# EAGLE design HotRod (EAGLE 7.1.0)
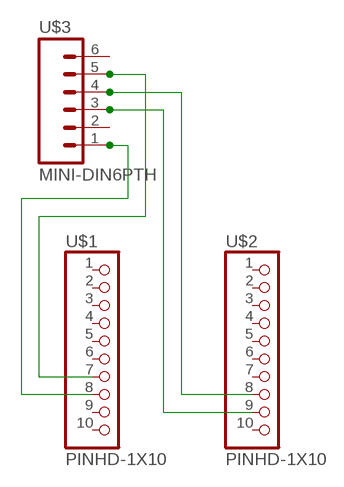
[diagram p0: schematic, sheet 1]

## Parts
U$1  PINHD-1X10  [1X10-BIG]
U$2  PINHD-1X10  [1X10-BIG]
U$3  MINI-DIN6PTH  [MINI-DIN6]

## Nets
N$1: U$1.8 U$3.1
N$2: U$1.7 U$3.5
N$3: U$2.8 U$3.4
N$5: U$2.9 U$3.3
Unconnected: U$1.1 U$1.2 U$1.3 U$1.4 U$1.5 U$1.6 U$1.9 U$1.10 U$2.1 U$2.2 U$2.3 U$2.4 U$2.5 U$2.6 U$2.7 U$2.10 U$3.2 U$3.6

## Library data of the parts
U$1 U$2 = adafruit:PINHD-1X10: Pin header 1x10 0.1" spacing With round pins
U$3 = SparkFun-Connectors:MINI-DIN6: mini DIN 6 Connector Commonly found on the back of a computer for PS2 keyboard and mice. Schematic and footprint are proven. Spark Fun Electronics SKU : PRT-08509

## Board
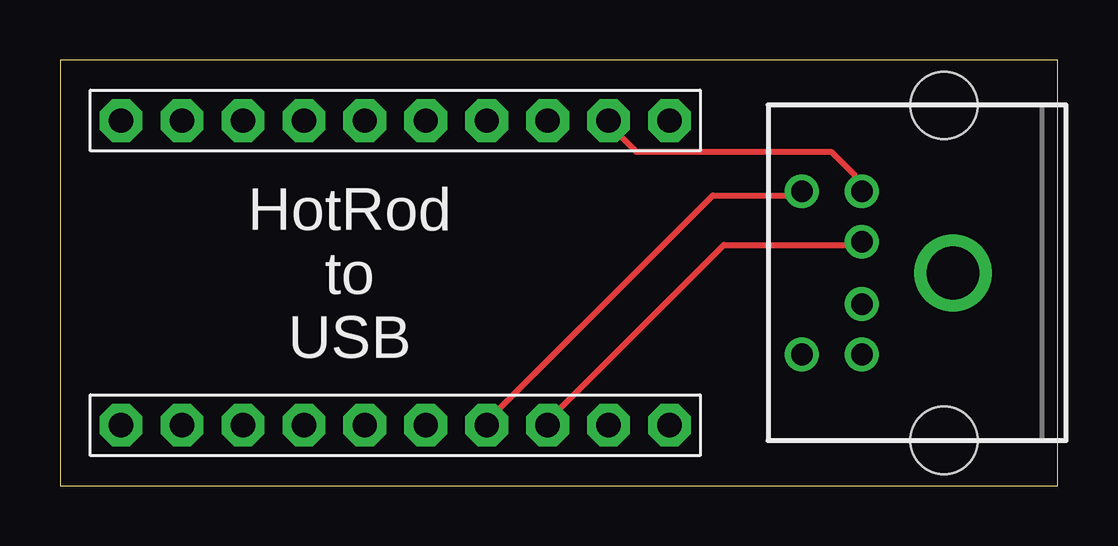
[diagram p1: board, top side]
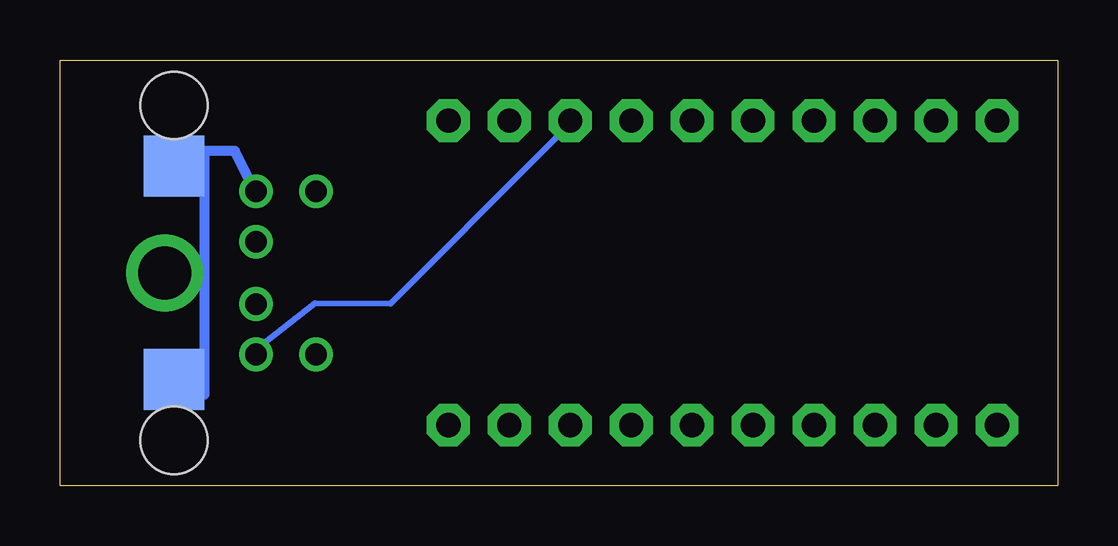
[diagram p2: board, bottom side, seen from below]

Size 41.58 x 17.77 mm. Coordinates in mm from the lower left corner, seen from the top.
Outline: 0,0 41.58,0 41.58,17.77 0,17.77 0,0
Copper layers (1*16): Top 0.035mm / dielectric 1.5mm / Bottom 0.035mm
Design rules "default": minimum track width 10mil, minimum drill 24mil, track to track 8mil, track to pad 8mil, pad to pad 8mil, via to via 8mil, smd to smd 8mil, copper to edge 40mil, drill to drill 8mil, minimum pad ring 10mil, minimum via ring 8mil, stop-mask expansion 4mil, vias tented up to drill 0mil, thermal gap 10mil

### Footprints (pad centres in the part's own frame; a part is rotated, then mirrored left to right if it is on the bottom)
1X10-BIG = drill 1.016 pad 1.778 octagon: 1 -11.43,0; 2 -8.89,0; 3 -6.35,0; 4 -3.81,0; 5 -1.27,0; 6 1.27,0; 7 3.81,0; 8 6.35,0; 9 8.89,0; 10 11.43,0
MINI-DIN6 = drill 0.9: 1 -1.3,-8.5; 2 1.3,-8.5; 3 -3.4,-8.5; 4 3.4,-8.5; 5 -3.4,-11; 6 3.4,-11 | drill 2.2: P$1 0,-4.7 | smd 2.54 x 2.54 bottom: P$2 -4.445,-5.08; P$3 4.445,-5.08 | hole 2.8: -6.985,-5.08; 6.985,-5.08

### Placement (x,y rotation side)
U$1  13.97,2.54 0 top
U$2  13.97,15.24 0 top
U$3  41.91,8.89 270 top

### Tracks (layer width: path | path; a pad name or v marks a point on that pad's centre or on a via)
N$1
  Top 0.254: U$3.1 33.38,10.06 27.66,10.06 20.34,2.74 U$1.8
N$2
  Top 0.254: U$3.5 30.86,12.12 27.2,12.12 17.83,2.74 U$1.7
N$3
  Bottom 0.254: U$3.4 33.38,5.71 30.96,7.62 27.81,7.59 21.49,13.95 20.34,15.09 U$2.8
N$4
  Bottom 0.406: 33.66,12.7 34.29,13.97 35.56,13.97 35.56,3.81
N$5
  Top 0.254: U$3.3 33.38,12.34 33.1,12.98 32.13,13.95 24,13.95 22.86,15.09 U$2.9

### Text on the board
tNames: HotRod / to / USB